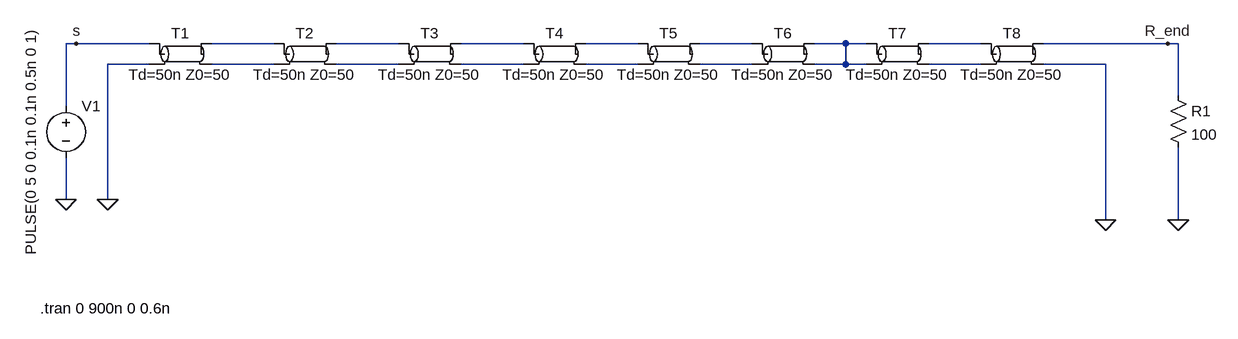
[diagram p0: schematic Draft14.asc]
Draft14.asc, the LTspice schematic file:
Version 4
SHEET 1 1732 680
WIRE -32 32 -48 32
WIRE 80 32 -32 32
WIRE 272 32 176 32
WIRE 464 32 368 32
WIRE 656 32 560 32
WIRE 832 32 752 32
WIRE 1008 32 928 32
WIRE 1152 32 1104 32
WIRE 1184 32 1152 32
WIRE 1360 32 1280 32
WIRE 1648 32 1456 32
WIRE 1664 32 1648 32
WIRE 80 64 16 64
WIRE 272 64 176 64
WIRE 464 64 368 64
WIRE 656 64 560 64
WIRE 832 64 752 64
WIRE 1008 64 928 64
WIRE 1152 64 1152 32
WIRE 1152 64 1104 64
WIRE 1184 64 1152 64
WIRE 1360 64 1280 64
WIRE 1552 64 1456 64
WIRE 1664 112 1664 32
WIRE -48 128 -48 32
WIRE -48 272 -48 208
WIRE 16 272 16 64
WIRE 1552 304 1552 64
WIRE 1664 304 1664 192
FLAG -48 272 0
FLAG 16 272 0
FLAG 1552 304 0
FLAG 1664 304 0
FLAG 1648 32 R_end
FLAG -32 32 s
SYMBOL voltage -48 112 R0
WINDOW 3 -54 -105 VRight 2
WINDOW 123 0 0 Left 0
WINDOW 39 0 0 Left 0
SYMATTR InstName V1
SYMATTR Value PULSE(0 5 0 0.1n 0.1n 0.5n 0 1)
SYMBOL tline 128 48 R0
SYMATTR InstName T1
SYMBOL tline 320 48 R0
SYMATTR InstName T2
SYMBOL tline 512 48 R0
SYMATTR InstName T3
SYMBOL tline 704 48 R0
SYMATTR InstName T4
SYMBOL tline 880 48 R0
SYMATTR InstName T5
SYMBOL tline 1056 48 R0
SYMATTR InstName T6
SYMBOL tline 1232 48 R0
SYMATTR InstName T7
SYMBOL tline 1408 48 R0
SYMATTR InstName T8
SYMBOL res 1648 96 R0
SYMATTR InstName R1
SYMATTR Value 100
TEXT -88 440 Left 2 !.tran 0 900n 0 0.6n

The netlist it stands for:
* Draft14.asc
V1 s 0 PULSE(0 5 0 0.1n 0.1n 0.5n 0 1)
T1 s 0 N001 N008 Td=50n Z0=50
T2 N001 N008 N002 N009 Td=50n Z0=50
T3 N002 N009 N003 N010 Td=50n Z0=50
T4 N003 N010 N004 N011 Td=50n Z0=50
T5 N004 N011 N005 N012 Td=50n Z0=50
T6 N005 N012 N006 N006 Td=50n Z0=50
T7 N006 N006 N007 N013 Td=50n Z0=50
T8 N007 N013 R_end 0 Td=50n Z0=50
R1 R_end 0 100
.tran 0 900n 0 0.6n
.backanno
.end